# Altium schematic sheet Top_level.SchDoc
size A3; SheetNumber: 1; SheetTotal: 5
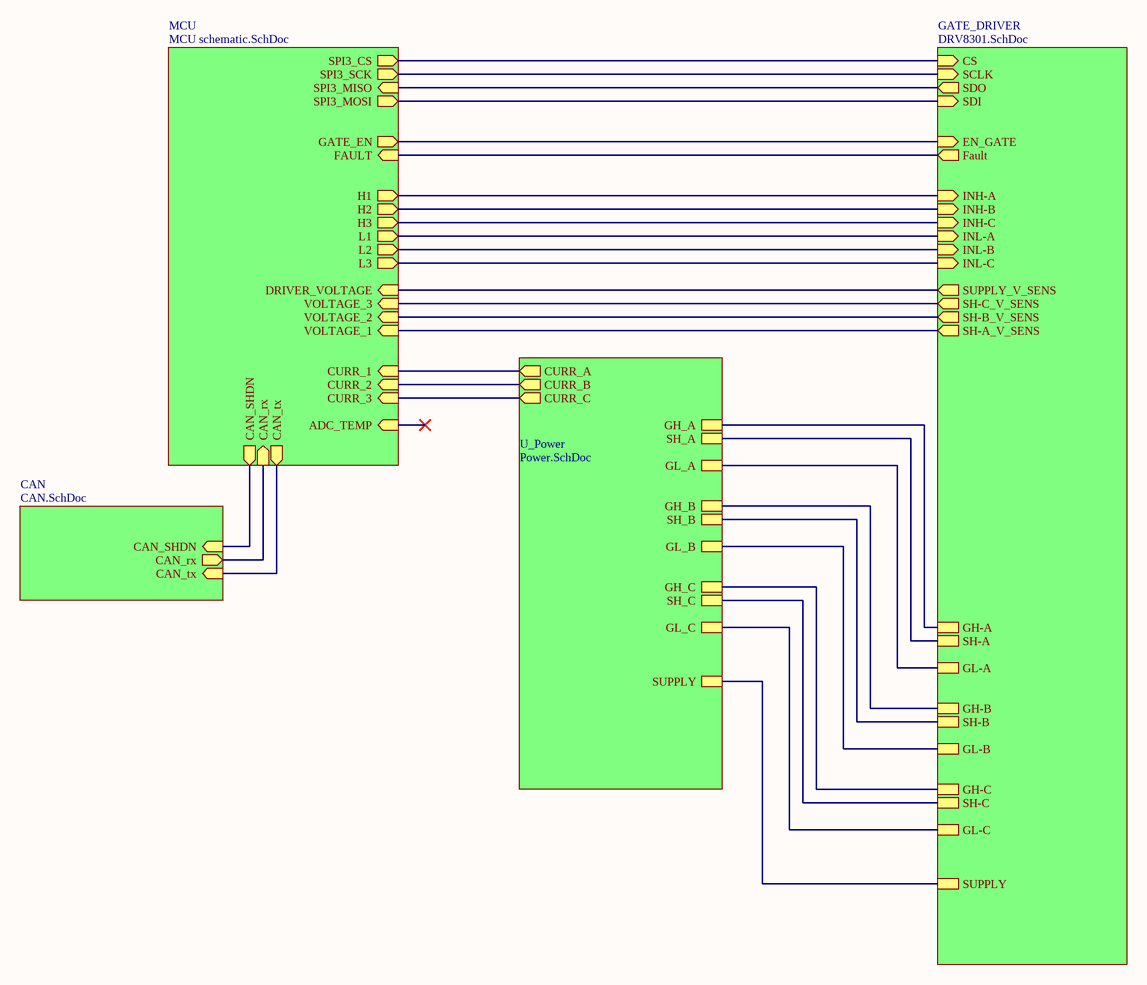
[diagram p0: Top_level.SchDoc]

## Sub-sheets
CAN = CAN.SchDoc: CAN_tx (in), CAN_rx (out), CAN_SHDN (in)
GATE_DRIVER = DRV8301.SchDoc: Fault (out), CS (in), SDI (in), SDO (out), SCLK (in), EN_GATE (in), INH-A (in), INL-A (in), INH-B (in), INL-B (in), INH-C (in), INL-C (in), SUPPLY, SH-A_V_SENS (out), SH-B_V_SENS (out), SH-C_V_SENS (out), SUPPLY_V_SENS (out), GL-C, GL-A, GH-B, SH-B, GL-B, GH-C, SH-C, GH-A, SH-A
MCU = MCU schematic.SchDoc: CAN_tx (out), CAN_rx (in), SPI3_SCK (out), SPI3_MISO (in), SPI3_MOSI (out), SPI3_CS (out), ADC_TEMP (in), CAN_SHDN (out), GATE_EN (out), FAULT (in), H1 (out), H2 (out), H3 (out), L1 (out), L2 (out), L3 (out), CURR_1 (in), CURR_2 (in), CURR_3 (in), VOLTAGE_1 (in), VOLTAGE_2 (in), VOLTAGE_3 (in), DRIVER_VOLTAGE (in)
U_Power = Power.SchDoc: GH_A, SH_A, GL_A, GH_B, GH_C, GL_B, GL_C, SH_B, SH_C, CURR_A (out), CURR_B (out), CURR_C (out), SUPPLY

## Nets
(unnamed): sheet CAN/CAN_tx, sheet MCU/CAN_tx
(unnamed): sheet CAN/CAN_rx, sheet MCU/CAN_rx
(unnamed): sheet CAN/CAN_SHDN, sheet MCU/CAN_SHDN
(unnamed): sheet U_Power/GH_A, sheet GATE_DRIVER/GH-A
(unnamed): sheet U_Power/SH_A, sheet GATE_DRIVER/SH-A
(unnamed): sheet U_Power/GL_A, sheet GATE_DRIVER/GL-A
(unnamed): sheet U_Power/GH_B, sheet GATE_DRIVER/GH-B
(unnamed): sheet U_Power/GH_C, sheet GATE_DRIVER/GH-C
(unnamed): sheet U_Power/GL_B, sheet GATE_DRIVER/GL-B
(unnamed): sheet U_Power/GL_C, sheet GATE_DRIVER/GL-C
(unnamed): sheet U_Power/SH_B, sheet GATE_DRIVER/SH-B
(unnamed): sheet U_Power/SH_C, sheet GATE_DRIVER/SH-C
(unnamed): sheet U_Power/CURR_A, sheet MCU/CURR_1
(unnamed): sheet U_Power/CURR_B, sheet MCU/CURR_2
(unnamed): sheet U_Power/CURR_C, sheet MCU/CURR_3
(unnamed): sheet U_Power/SUPPLY, sheet GATE_DRIVER/SUPPLY
(unnamed): sheet MCU/SPI3_SCK, sheet GATE_DRIVER/SCLK
(unnamed): sheet MCU/SPI3_MISO, sheet GATE_DRIVER/SDO
(unnamed): sheet MCU/SPI3_MOSI, sheet GATE_DRIVER/SDI
(unnamed): sheet MCU/SPI3_CS, sheet GATE_DRIVER/CS
(unnamed): sheet MCU/GATE_EN, sheet GATE_DRIVER/EN_GATE
(unnamed): sheet MCU/FAULT, sheet GATE_DRIVER/Fault
(unnamed): sheet MCU/H1, sheet GATE_DRIVER/INH-A
(unnamed): sheet MCU/H2, sheet GATE_DRIVER/INH-B
(unnamed): sheet MCU/H3, sheet GATE_DRIVER/INH-C
(unnamed): sheet MCU/L1, sheet GATE_DRIVER/INL-A
(unnamed): sheet MCU/L2, sheet GATE_DRIVER/INL-B
(unnamed): sheet MCU/L3, sheet GATE_DRIVER/INL-C
(unnamed): sheet MCU/VOLTAGE_1, sheet GATE_DRIVER/SH-A_V_SENS
(unnamed): sheet MCU/VOLTAGE_2, sheet GATE_DRIVER/SH-B_V_SENS
(unnamed): sheet MCU/VOLTAGE_3, sheet GATE_DRIVER/SH-C_V_SENS
(unnamed): sheet MCU/DRIVER_VOLTAGE, sheet GATE_DRIVER/SUPPLY_V_SENS